# Altium schematic sheet 2.5V_REF.SchDoc
size A4; Author: K. Patel / D. Hufnagel; Organization: UltraZohm; SheetNumber: 9; SheetTotal: 9; Website: www.ultrazohm.com
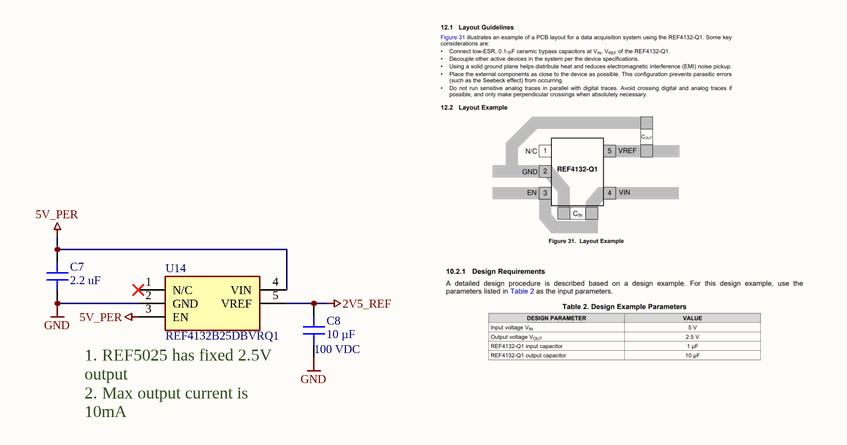
[diagram p0: 2.5V_REF.SchDoc]

## Parts
C7  2.2 uF  [C_0603]
C8  10 µF  Voltage Rating: 100 VDC  [C_1210_N]
U14  REF4132B25DBVRQ1  [SOT95P280X145-5N]

## Nets
2V5_REF: C8.2 U14.5(VREF)
5V_PER: C7.2 U14.3(EN) U14.4(VIN)
GND: C7.1 C8.1 U14.2(GND)

Not connected (* = marked no-connect by the designer): U14 1(N/C)*

## Notes on the sheet
- 1. REF5025 has fixed 2.5V output
  2. Max output current is 10mA
- Title
- Revision:
- Design Engineer:
- Date:
- Project:
- Sheet
- of

## Library data of the parts
C7 = C1608X5R1E225K080AB: Capacitor 0603, 25 VDC, 2.2 uF, X5R; Manufacturer: TDK; Tolerance: 10 %; Voltage Rating: 25VDC; Created from: DHufnagel; Manufacturer Part Number: C1608X5R1E225K080AB; PartID: 96; Created On: 20.07.2022 09:02:16; ComponentLink1Description: Datasheet; ComponentLink1URL: https://product.tdk.com/system/files/dam/doc/product/capacitor/ceramic/mlcc/catalog/mlcc_commercial_general_en.pdf?ref_disty=mouser; Component Type: Capacitor 0603; Device Package: 0603; Last Updated: 20.07.2022 09:02:16; Mounting Type: SMD; Operating Temperature: -55 - 85°C; Series: X5R; Supplier 1: Mouser; Supplier Part Number 1: 810-C1608X5R1E225K; Supplier 2: LCSC; Supplier Part Number 2: C2929194; Type: Capacitor; Value: 2.2 uF; Live Cycle Status: 1; LCSC Part Number: C2929194; Stock number: not stored
C8 = GRM32EC72A106KE05L: Capacitor 1210, 100 VDC, 10µF, X7S; Manufacturer: Murata Electronics; Tolerance: 10 %; Created from: DHufnagel; Manufacturer Part Number: GRM32EC72A106KE05L; PartID: 118; Created On: 21.12.2022 14:25:08; ComponentLink1Description: Datasheet; ComponentLink1URL: https://www.mouser.de/datasheet/2/281/1/GRM32EC72A106KE05_01A-1988109.pdf; Component Type: Capacitor 1210; Device Package: 1210; Last Updated: 21.02.2024 14:40:52; Mounting Type: SMD; Operating Temperature: -55 - 125°C; Series: GRM; Supplier 1: Mouser; Supplier Part Number 1: 81-GRM32EC72A106KE05; Type: Capacitor; Value: 10 µF; Live Cycle Status: 1; Stock number: not stored; Supplier 2: LCSC; Supplier Part Number 2: C576517; LCSC Part Number: C576517
U14 = REF4132B25DBVRQ1: Voltage Reference, 2.5V, ±0.05%, ±10mA; Manufacturer: Texas Instruments; Created from: DHufnagel; Manufacturer Part Number: REF4132B25DBVRQ1; PartID: 10; Created On: 08.07.2022 12:48:56; ComponentLink1Description: Datasheet; ComponentLink1URL: https://www.ti.com/general/docs/suppproductinfo.tsp?distId=26&gotoUrl=https://www.ti.com/lit/gpn/ref4132-q1; Component Type: Voltage Reference; Device Package: SMD; Last Updated: 08.07.2022 12:59:37; Mounting Type: SMD; Operating Temperature: -40 - 125 °C; Series: -40 - 125 °C; Supplier 1: Mouser; Supplier Part Number 1: 595-REF4132B25DBVRQ1; Supplier 2: Digi-Key; Supplier Part Number 2: 296-REF4132B25DBVRQ1CT-ND; Type: Voltage Reference; Value: 2.5 V; Live Cycle Status: 1; Stock number: not stored